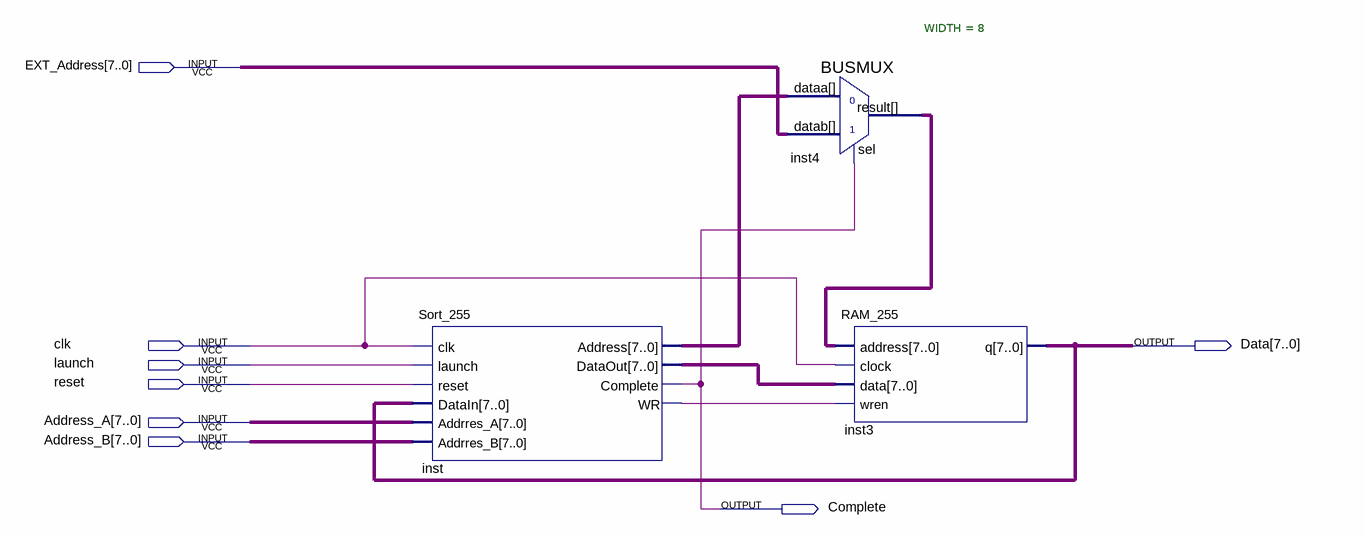
[diagram p0: schematic sheet]
// Quartus schematic Sorter_V2_255.bdf as structural Verilog: 3 symbols, 8 pins
module Sorter_V2_255 (
  input  [7:0] EXT_Address,
  input  clk,
  input  launch,
  input  reset,
  input  [7:0] Address_A,
  input  [7:0] Address_B,
  output [7:0] Data,
  output Complete
);

  wire inst_wr;
  wire [7:0] inst4_result, inst_address, inst_dataout;

  Sort_255 inst (
    .clk(clk), .launch(launch), .reset(reset), .DataIn(Data), .Addrres_A(Address_A), .Addrres_B(Address_B),
    .Address(inst_address), .DataOut(inst_dataout), .Complete(Complete), .WR(inst_wr));
  BUSMUX #(.WIDTH(8)) inst4 (.datab(EXT_Address), .sel(Complete), .dataa(inst_address), .result(inst4_result));
  RAM_255 inst3 (.address(inst4_result), .clock(clk), .data(inst_dataout), .wren(inst_wr), .q(Data));
endmodule
